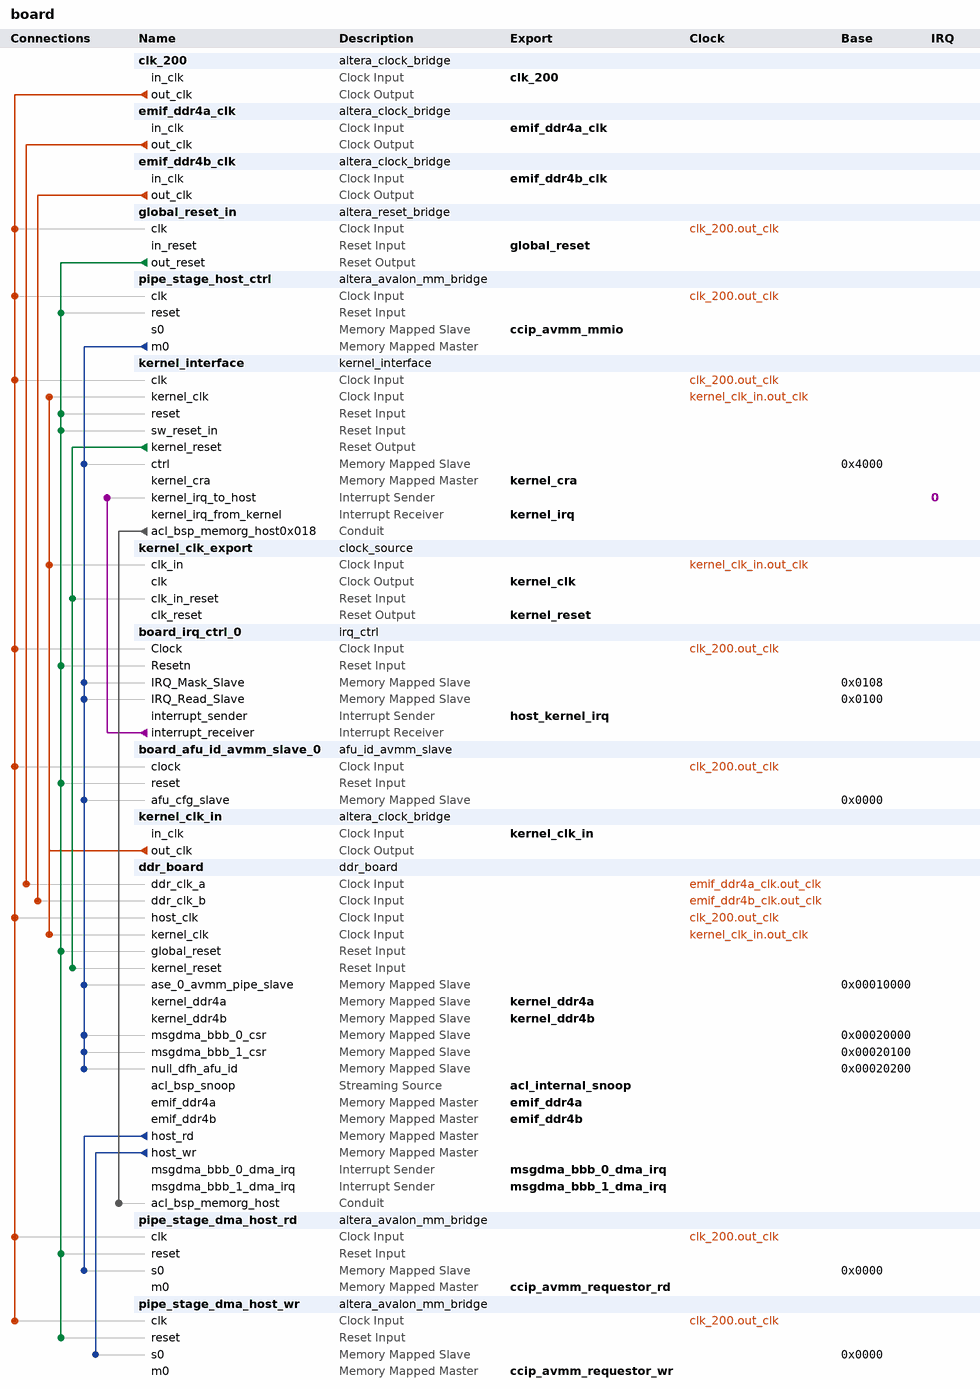
[diagram p0: system contents]
# Platform Designer (Qsys) system board, Arria 10 10AX115N2F40E2LG
# Parameters at their usual value, and those the tool derives, are not listed.
package require -exact qsys 1.0
create_system board
set_project_property DEVICE_FAMILY {Arria 10}
set_project_property DEVICE 10AX115N2F40E2LG

add_component clk_200 ip/board/board_clk_200.ip altera_clock_bridge clk_200 19.1

add_component emif_ddr4a_clk ip/board/board_clock_bridge_0.ip altera_clock_bridge emif_ddr4a_clk 19.1

add_component emif_ddr4b_clk ip/board/board_clock_bridge_1.ip altera_clock_bridge emif_ddr4b_clk 19.1
load_component emif_ddr4b_clk
set_component_parameter_value DERIVED_CLOCK_RATE 0
set_component_parameter_value EXPLICIT_CLOCK_RATE 266000000
save_component

add_component global_reset_in ip/board/board_global_reset_in.ip altera_reset_bridge global_reset_in 19.1

add_component pipe_stage_host_ctrl ip/board/board_pipe_stage_host_ctrl.ip altera_avalon_mm_bridge pipe_stage_host_ctrl 19.1
load_component pipe_stage_host_ctrl
set_component_parameter_value DATA_WIDTH 64
set_component_parameter_value ADDRESS_WIDTH 18
set_component_parameter_value USE_AUTO_ADDRESS_WIDTH 0
set_component_parameter_value ADDRESS_UNITS SYMBOLS
set_component_parameter_value MAX_PENDING_RESPONSES 1
set_component_parameter_value SYNC_RESET 0
save_component

add_component kernel_interface ip/board/board_kernel_interface.ip kernel_interface kernel_interface 15.1

add_component kernel_clk_export ip/board/board_kernel_clk_export.ip clock_source kernel_clk_export 

add_component board_irq_ctrl_0 ip/board/board_irq_ctrl_0.ip irq_ctrl board_irq_ctrl_0 1.0
load_component board_irq_ctrl_0
save_component

add_component board_afu_id_avmm_slave_0 ip/board/board_afu_id_avmm_slave_0.ip afu_id_avmm_slave board_afu_id_avmm_slave_0 1.0

add_component kernel_clk_in ip/board/board_kernel_clk_in.ip altera_clock_bridge kernel_clk_in 19.1

add_component ddr_board ddr_board.qsys ddr_board ddr_board 

add_component pipe_stage_dma_host_rd ip/board/pipe_stage_msgdma_csr_0.ip altera_avalon_mm_bridge pipe_stage_dma_host_rd 19.1
load_component pipe_stage_dma_host_rd
set_component_parameter_value DATA_WIDTH 512
set_component_parameter_value ADDRESS_WIDTH 48
set_component_parameter_value USE_AUTO_ADDRESS_WIDTH 0
set_component_parameter_value ADDRESS_UNITS SYMBOLS
set_component_parameter_value MAX_BURST_SIZE 4
set_component_parameter_value MAX_PENDING_RESPONSES 64
set_component_parameter_value SYNC_RESET 0
save_component

add_component pipe_stage_dma_host_wr ip/board/pipe_stage_dma_host_rd_0.ip altera_avalon_mm_bridge pipe_stage_dma_host_wr 19.1

# connections
add_connection clk_200.out_clk board_afu_id_avmm_slave_0.clock clock
add_connection clk_200.out_clk board_irq_ctrl_0.Clock clock
add_connection clk_200.out_clk ddr_board.host_clk clock
add_connection clk_200.out_clk global_reset_in.clk clock
add_connection clk_200.out_clk kernel_interface.clk clock
add_connection clk_200.out_clk pipe_stage_dma_host_rd.clk clock
add_connection clk_200.out_clk pipe_stage_dma_host_wr.clk clock
add_connection clk_200.out_clk pipe_stage_host_ctrl.clk clock
add_connection emif_ddr4a_clk.out_clk ddr_board.ddr_clk_a clock
add_connection emif_ddr4b_clk.out_clk ddr_board.ddr_clk_b clock
add_connection kernel_clk_in.out_clk ddr_board.kernel_clk clock
add_connection kernel_clk_in.out_clk kernel_clk_export.clk_in clock
add_connection kernel_clk_in.out_clk kernel_interface.kernel_clk clock
add_connection global_reset_in.out_reset board_afu_id_avmm_slave_0.reset reset
add_connection global_reset_in.out_reset board_irq_ctrl_0.Resetn reset
add_connection global_reset_in.out_reset ddr_board.global_reset reset
add_connection global_reset_in.out_reset kernel_interface.reset reset
add_connection global_reset_in.out_reset kernel_interface.sw_reset_in reset
add_connection global_reset_in.out_reset pipe_stage_dma_host_rd.reset reset
add_connection global_reset_in.out_reset pipe_stage_dma_host_wr.reset reset
add_connection global_reset_in.out_reset pipe_stage_host_ctrl.reset reset
add_connection kernel_interface.kernel_reset ddr_board.kernel_reset reset
add_connection kernel_interface.kernel_reset kernel_clk_export.clk_in_reset reset
add_connection ddr_board.host_rd pipe_stage_dma_host_rd.s0 avalon
set_connection_parameter_value ddr_board.host_rd/pipe_stage_dma_host_rd.s0 baseAddress 0x0000
add_connection ddr_board.host_wr pipe_stage_dma_host_wr.s0 avalon
set_connection_parameter_value ddr_board.host_wr/pipe_stage_dma_host_wr.s0 baseAddress 0x0000
add_connection pipe_stage_host_ctrl.m0 board_afu_id_avmm_slave_0.afu_cfg_slave avalon
set_connection_parameter_value pipe_stage_host_ctrl.m0/board_afu_id_avmm_slave_0.afu_cfg_slave baseAddress 0x0000
add_connection pipe_stage_host_ctrl.m0 board_irq_ctrl_0.IRQ_Mask_Slave avalon
set_connection_parameter_value pipe_stage_host_ctrl.m0/board_irq_ctrl_0.IRQ_Mask_Slave baseAddress 0x0108
add_connection pipe_stage_host_ctrl.m0 board_irq_ctrl_0.IRQ_Read_Slave avalon
set_connection_parameter_value pipe_stage_host_ctrl.m0/board_irq_ctrl_0.IRQ_Read_Slave baseAddress 0x0100
add_connection pipe_stage_host_ctrl.m0 ddr_board.ase_0_avmm_pipe_slave avalon
set_connection_parameter_value pipe_stage_host_ctrl.m0/ddr_board.ase_0_avmm_pipe_slave baseAddress 0x00010000
add_connection pipe_stage_host_ctrl.m0 ddr_board.msgdma_bbb_0_csr avalon
set_connection_parameter_value pipe_stage_host_ctrl.m0/ddr_board.msgdma_bbb_0_csr baseAddress 0x00020000
add_connection pipe_stage_host_ctrl.m0 ddr_board.msgdma_bbb_1_csr avalon
set_connection_parameter_value pipe_stage_host_ctrl.m0/ddr_board.msgdma_bbb_1_csr baseAddress 0x00020100
add_connection pipe_stage_host_ctrl.m0 ddr_board.null_dfh_afu_id avalon
set_connection_parameter_value pipe_stage_host_ctrl.m0/ddr_board.null_dfh_afu_id baseAddress 0x00020200
add_connection pipe_stage_host_ctrl.m0 kernel_interface.ctrl avalon
set_connection_parameter_value pipe_stage_host_ctrl.m0/kernel_interface.ctrl baseAddress 0x4000
add_connection kernel_interface.acl_bsp_memorg_host0x018 ddr_board.acl_bsp_memorg_host conduit
add_connection board_irq_ctrl_0.interrupt_receiver kernel_interface.kernel_irq_to_host interrupt
set_connection_parameter_value board_irq_ctrl_0.interrupt_receiver/kernel_interface.kernel_irq_to_host irqNumber 0

# exported interfaces
add_interface acl_internal_snoop avalon_streaming source
set_interface_property acl_internal_snoop EXPORT_OF ddr_board.acl_bsp_snoop
add_interface ccip_avmm_mmio avalon slave
set_interface_property ccip_avmm_mmio EXPORT_OF pipe_stage_host_ctrl.s0
add_interface ccip_avmm_requestor_rd avalon master
set_interface_property ccip_avmm_requestor_rd EXPORT_OF pipe_stage_dma_host_rd.m0
add_interface ccip_avmm_requestor_wr avalon master
set_interface_property ccip_avmm_requestor_wr EXPORT_OF pipe_stage_dma_host_wr.m0
add_interface clk_200 clock sink
set_interface_property clk_200 EXPORT_OF clk_200.in_clk
add_interface emif_ddr4a avalon master
set_interface_property emif_ddr4a EXPORT_OF ddr_board.emif_ddr4a
add_interface emif_ddr4a_clk clock sink
set_interface_property emif_ddr4a_clk EXPORT_OF emif_ddr4a_clk.in_clk
add_interface emif_ddr4b avalon master
set_interface_property emif_ddr4b EXPORT_OF ddr_board.emif_ddr4b
add_interface emif_ddr4b_clk clock sink
set_interface_property emif_ddr4b_clk EXPORT_OF emif_ddr4b_clk.in_clk
add_interface global_reset reset sink
set_interface_property global_reset EXPORT_OF global_reset_in.in_reset
add_interface host_kernel_irq interrupt sender
set_interface_property host_kernel_irq EXPORT_OF board_irq_ctrl_0.interrupt_sender
add_interface kernel_clk clock source
set_interface_property kernel_clk EXPORT_OF kernel_clk_export.clk
add_interface kernel_clk_in clock sink
set_interface_property kernel_clk_in EXPORT_OF kernel_clk_in.in_clk
add_interface kernel_cra avalon master
set_interface_property kernel_cra EXPORT_OF kernel_interface.kernel_cra
add_interface kernel_ddr4a avalon slave
set_interface_property kernel_ddr4a EXPORT_OF ddr_board.kernel_ddr4a
add_interface kernel_ddr4b avalon slave
set_interface_property kernel_ddr4b EXPORT_OF ddr_board.kernel_ddr4b
add_interface kernel_irq interrupt receiver
set_interface_property kernel_irq EXPORT_OF kernel_interface.kernel_irq_from_kernel
add_interface kernel_reset reset source
set_interface_property kernel_reset EXPORT_OF kernel_clk_export.clk_reset
add_interface msgdma_bbb_0_dma_irq interrupt sender
set_interface_property msgdma_bbb_0_dma_irq EXPORT_OF ddr_board.msgdma_bbb_0_dma_irq
add_interface msgdma_bbb_1_dma_irq interrupt sender
set_interface_property msgdma_bbb_1_dma_irq EXPORT_OF ddr_board.msgdma_bbb_1_dma_irq

save_system board.qsys
